# Altium project PYRAMIDE CONTROLLER VER01 REVA.PrjPcb (part 1 of 2)
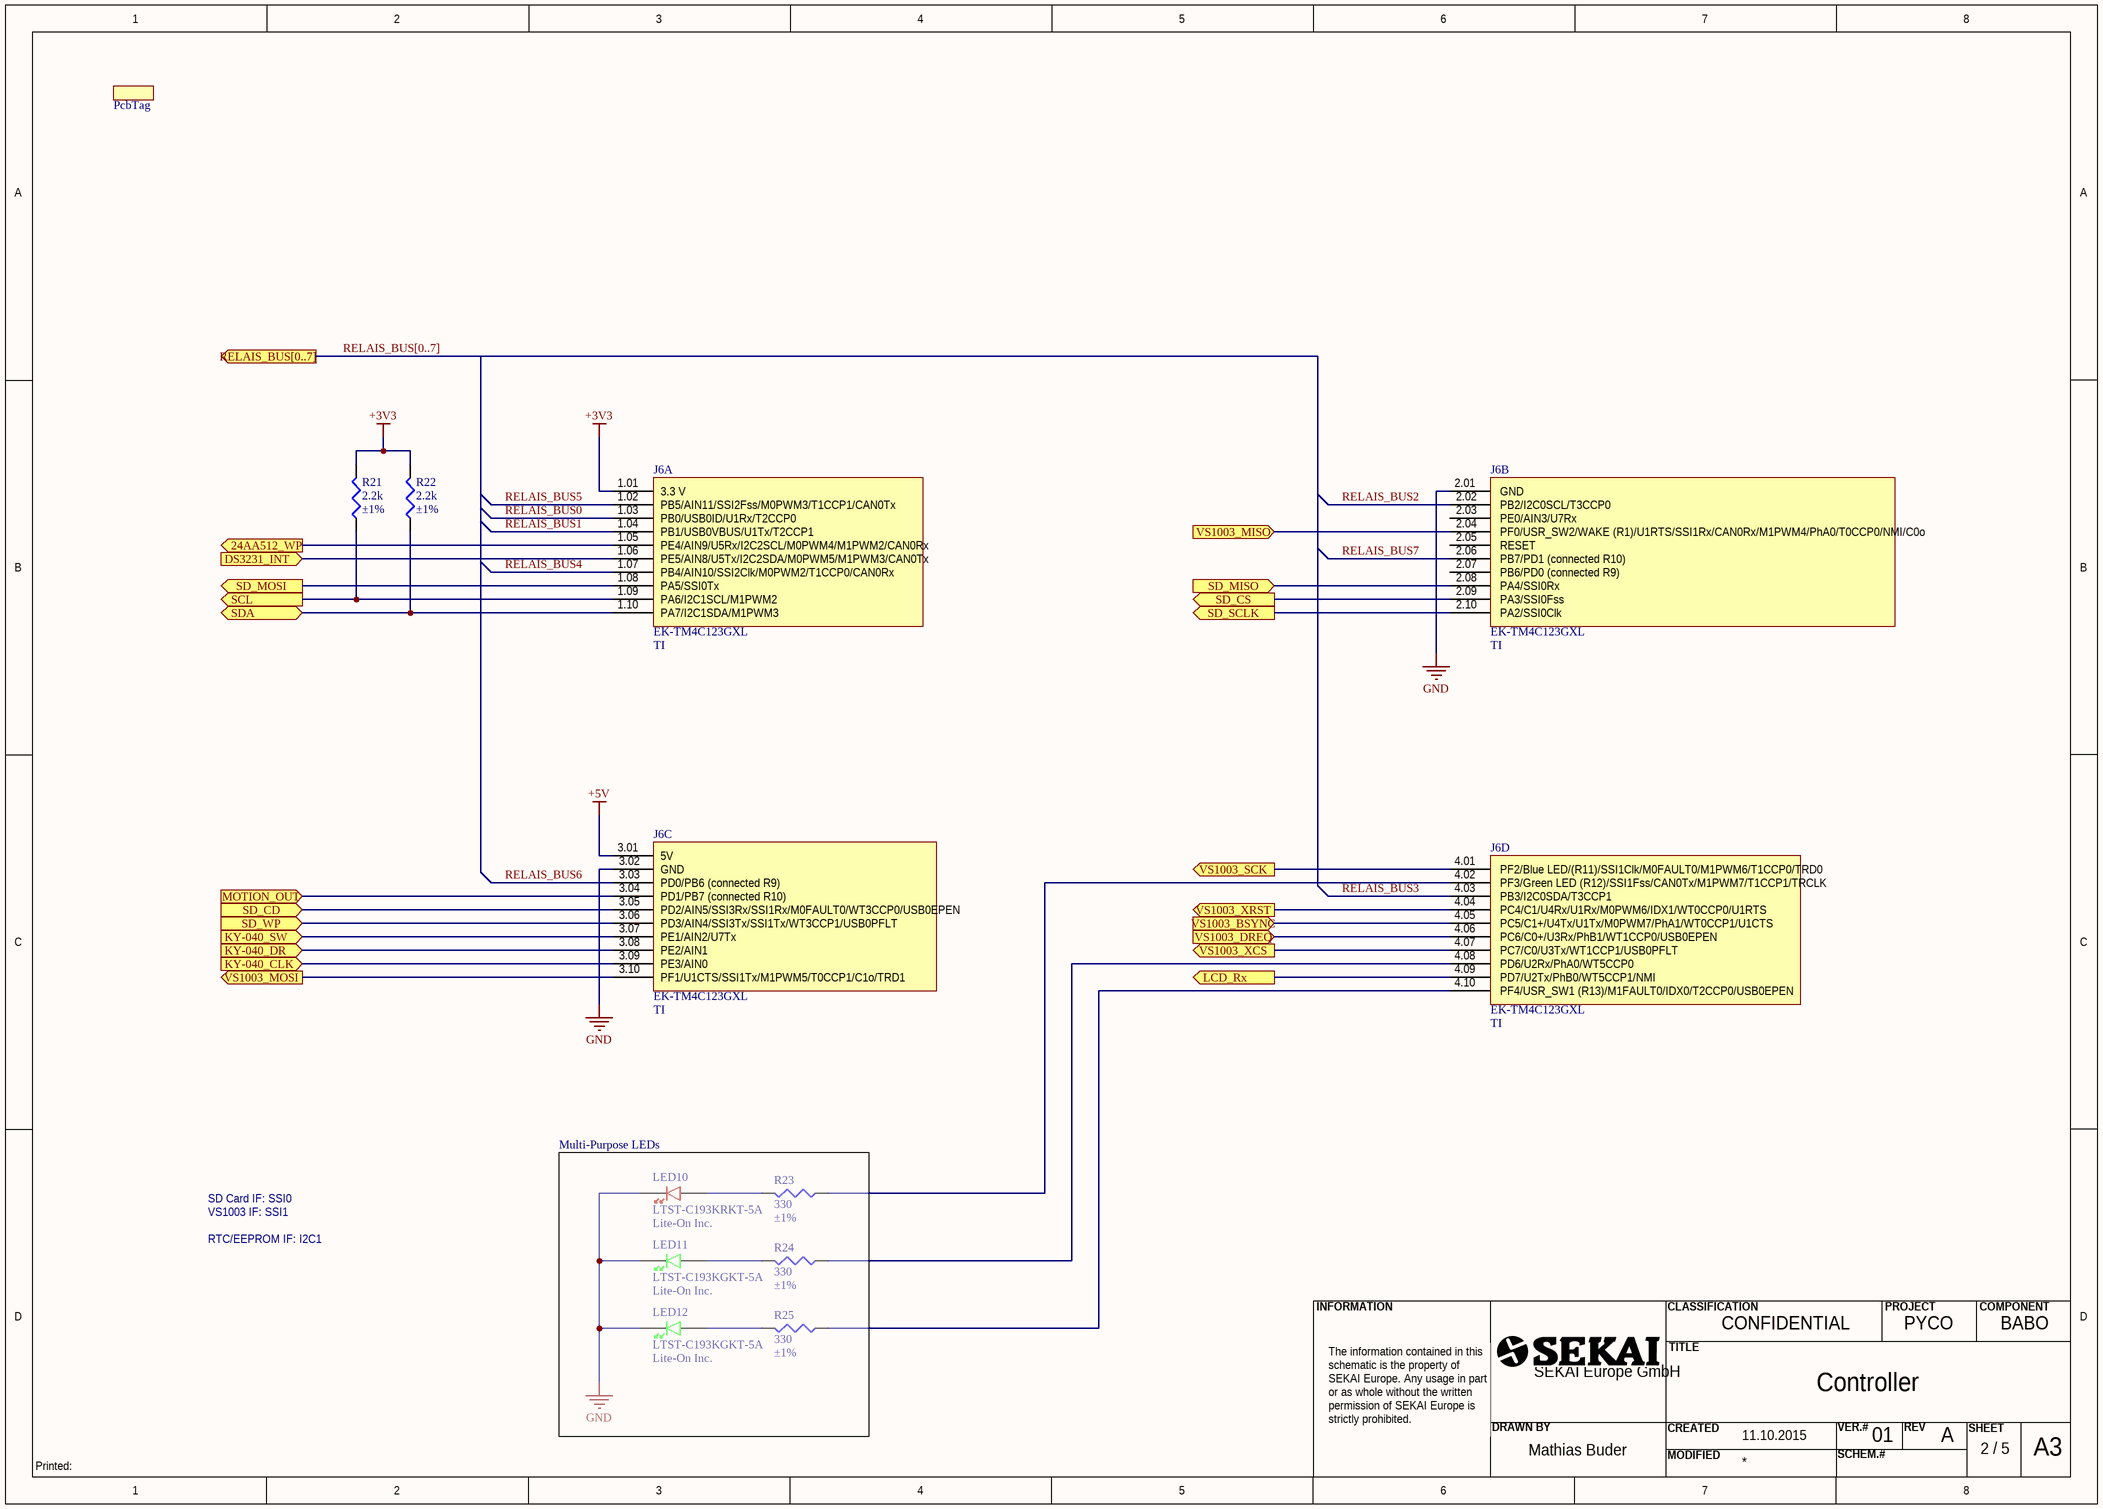
[diagram p0: Controller.SchDoc]
Classification: CONFIDENTIAL; Component: BABO; Drawn by: Mathias Buder; Project: PYCO; ProjectTitle: Pyramide Controller; REV: A; VER: 01
4 sheets, 96 parts. Net scope: flat (ports and power ports of the same name join across sheets).
Board file: PYCO_PCB_VER01_REVA.PcbDoc
Sheets:
  Controller.SchDoc
  Power Supply.SchDoc
  RTC-EEPROM.SchDoc
  Connectors.SchDoc

## Sheet Controller.SchDoc: Controller
size A3; Date: 11.10.2015; DocumentNumber: 2; Revision: 11; SheetNumber: 2; SheetTotal: 5

### Parts
?  PcbTag  [PcbTag]
J6  EK-TM4C123GXL  Manufacturer: TI  [EK-TM4C123GXL]  (parts A,B,C,D of 4)
LED10  LTST-C193KRKT-5A  Manufacturer: Lite-On Inc.  [LED0603-RED]
LED11  LTST-C193KGKT-5A  Manufacturer: Lite-On Inc.  [LED0603-GREEN]
LED12  LTST-C193KGKT-5A  Manufacturer: Lite-On Inc.  [LED0603-GREEN]
R21  Resistance (Ohms): 2.2k  Tolerance: ±1%  [R0603]  (hidden comment: ERJ-3EKF2201V)
R22  Resistance (Ohms): 2.2k  Tolerance: ±1%  [R0603]  (hidden comment: ERJ-3EKF2201V)
R23  Resistance (Ohms): 330  Tolerance: ±1%  [R0603]  (hidden comment: ERJ-3EKF3300V)
R24  Resistance (Ohms): 330  Tolerance: ±1%  [R0603]  (hidden comment: ERJ-3EKF3300V)
R25  Resistance (Ohms): 330  Tolerance: ±1%  [R0603]  (hidden comment: ERJ-3EKF3300V)

### Blocks framed on the sheet
Multi-Purpose LEDs: LED10-LED12 R23-R25

### Ports
24AA512_WP (out), DS3231_INT (in), KY-040_CLK (in), KY-040_DR (in), KY-040_SW (in), LCD_Rx (out), MOTION_OUT (in), RELAIS_BUS[0..7] (out), SCL (out), SD_CD (in), SD_CS (out), SD_MISO (in), SD_MOSI (out), SD_SCLK (out), SD_WP (in), SDA (bidir), VS1003_BSYNC (in), VS1003_DREQ (in), VS1003_MISO (in), VS1003_MOSI (out), VS1003_SCK (out), VS1003_XCS (out), VS1003_XRST (out)

### Nets
+3V3: J6.1.01(3.3_V) R21.2 R22.2
+5V: J6.3.01(5V)
GND: J6.2.01(GND) J6.3.02(GND) LED10.2(CATHODE) LED11.2(CATHODE) LED12.2(CATHODE)
RELAIS_BUS0: J6.1.03(PB0/USB0ID/U1Rx/T2CCP0)
RELAIS_BUS1: J6.1.04(PB1/USB0VBUS/U1Tx/T2CCP1)
RELAIS_BUS2: J6.2.02(PB2/I2C0SCL/T3CCP0)
RELAIS_BUS3: J6.4.03(PB3/I2C0SDA/T3CCP1)
RELAIS_BUS4: J6.1.07(PB4/AIN10/SSI2Clk/M0PWM2/T1CCP0/CAN0Rx)
RELAIS_BUS5: J6.1.02(PB5/AIN11/SSI2Fss/M0PWM3/T1CCP1/CAN0Tx)
RELAIS_BUS6: J6.3.03(PD0/PB6_(connected_R9))
RELAIS_BUS7: J6.2.06(PB7/PD1_(connected_R10))
NetIC1_5: J6.1.10(PA7/I2C1SDA/M1PWM3) R22.1 ; port SDA
NetIC1_6: J6.1.09(PA6/I2C1SCL/M1PWM2) R21.1 ; port SCL
NetIC1_7: J6.1.05(PE4/AIN9/U5Rx/I2C2SCL/M0PWM4/M1PWM2/CAN0Rx) ; port 24AA512_WP
NetIC2_3: J6.1.06(PE5/AIN8/U5Tx/I2C2SDA/M0PWM5/M1PWM3/CAN0Tx) ; port DS3231_INT
NetIC3_2: J6.3.07(PE1/AIN2/U7Tx) ; port KY-040_SW
NetIC3_3: J6.3.08(PE2/AIN1) ; port KY-040_DR
NetIC3_4: J6.3.09(PE3/AIN0) ; port KY-040_CLK
NetIC4_3: J6.4.09(PD7/U2Tx/PhB0/WT5CCP1/NMI) ; port LCD_Rx
NetJ3_2: J6.3.04(PD1/PB7_(connected_R10)) ; port MOTION_OUT
NetJ4_1: J6.4.05(PC5/C1+/U4Tx/U1Tx/M0PWM7/PhA1/WT0CCP1/U1CTS) ; port VS1003_BSYNC
NetJ4_2: J6.4.07(PC7/C0/U3Tx/WT1CCP1/USB0PFLT) ; port VS1003_XCS
NetJ4_3: J6.4.04(PC4/C1/U4Rx/U1Rx/M0PWM6/IDX1/WT0CCP0/U1RTS) ; port VS1003_XRST
NetJ4_4: J6.4.06(PC6/C0+/U3Rx/PhB1/WT1CCP0/USB0EPEN) ; port VS1003_DREQ
NetJ4_5: J6.4.01(PF2/Blue_LED/(R11)/SSI1Clk/M0FAULT0/M1PWM6/T1CCP0/TRD0) ; port VS1003_SCK
NetJ4_6: J6.3.10(PF1/U1CTS/SSI1Tx/M1PWM5/T0CCP1/C1o/TRD1) ; port VS1003_MOSI
NetJ4_7: J6.2.04(PF0/USR_SW2/WAKE_(R1)/U1RTS/SSI1Rx/CAN0Rx/M1PWM4/PhA0/T0CCP0/NMI/C0o) ; port VS1003_MISO
NetJ6_1.08: J6.1.08(PA5/SSI0Tx) ; port SD_MOSI
NetJ6_2.08: J6.2.08(PA4/SSI0Rx) ; port SD_MISO
NetJ6_2.09: J6.2.09(PA3/SSI0Fss) ; port SD_CS
NetJ6_2.10: J6.2.10(PA2/SSI0Clk) ; port SD_SCLK
NetJ6_3.05: J6.3.05(PD2/AIN5/SSI3Rx/SSI1Rx/M0FAULT0/WT3CCP0/USB0EPEN) ; port SD_CD
NetJ6_3.06: J6.3.06(PD3/AIN4/SSI3Tx/SSI1Tx/WT3CCP1/USB0PFLT) ; port SD_WP
NetJ6_4.02: J6.4.02(PF3/Green_LED_(R12)/SSI1Fss/CAN0Tx/M1PWM7/T1CCP1/TRCLK) R23.1
NetJ6_4.08: J6.4.08(PD6/U2Rx/PhA0/WT5CCP0) R24.1
NetJ6_4.10: J6.4.10(PF4/USR_SW1_(R13)/M1FAULT0/IDX0/T2CCP0/USB0EPEN) R25.1
NetLED10_1: LED10.1(ANODE) R23.2
NetLED11_1: LED11.1(ANODE) R24.2
NetLED12_1: LED12.1(ANODE) R25.2

Not connected (* = marked no-connect by the designer): J6 2.03(PE0/AIN3/U7Rx) 2.05(RESET) 2.07(PB6/PD0_(connected_R9))

### Buses and harness runs
bus RELAIS_BUS[0..7] = port RELAIS_BUS[0..7]

### Notes on the sheet
- VS1003 IF: SSI1
- SD Card IF: SSI0
- RTC/EEPROM IF: I2C1
- INFORMATION
- CLASSIFICATION
- PROJECT
- COMPONENT
- SEKAI Europe GmbH
- TITLE
- The information contained in this schematic is the property of SEKAI Europe. Any usage in part or as whole without the written permission of SEKAI Europe is strictly prohibited.
- DRAWN BY
- CREATED
- MODIFIED
- VER.#
- SCHEM.#
- REV
- SHEET
- A3
- Printed:

### Library data of the parts
J6 = EK-TM4C123GXL: EVAL KIT TM4C123GXL LAUNCHPAD; Board Type: Evaluation Platform; Core Processor: ARM® Cortex®-M4F; Platform: LaunchPad™; Contents: Board(s), Cable(s); Supplier 1: Digi-Key; Manufacturer Part Number: EK-TM4C123GXL; RoHS: RoHS Compliant By Exemption; Category: Programmers, Development Systems; Stock 1: 1173; Pricing 1: 1=12.03 (EUR); Type: MCU 32-Bit; Operating System: -; For Use With/Related Products: TM4C123G; Mounting Type: Fixed; ComponentLink1URL: http://www.ti.com/lit/pdf/spmu296; ComponentLink1Description: http://www.ti.com/lit/pdf/spmu296; Supplier Part Number 1: 296-35760-ND
LED10 = LTST-C193KRKT-5A: LED RED CLEAR 0603 SMD; Wavelength - Dominant: 631nm; Wavelength - Peak: 639nm; Millicandela Rating: 26.05mcd; Voltage - Forward (Vf) (Typ): 2V; Current - Test: 5mA; Viewing Angle: 130°; Lens Color: Colorless; Lens Style/Size: Rectangle with Flat Top, 1.15mm x 0.80mm; Supplier 1: Digi-Key; Manufacturer Part Number: LTST-C193KRKT-5A; RoHS: RoHS Compliant; Category: Optoelectronics; Stock 1: 115770; Pricing 1: 1=0.38, 10=0.276, 100=0.1461, 250=0.10336, 500=0.0882, 1000=0.0689 (EUR); Packaging: Cut Tape (CT); Color: Red; Lens Transparency: Clear; Package / Case: 0603 (1608 Metric); Supplier Device Package: *; Size / Dimension: 1.60mm L x 0.80mm W; Height (Max): 0.35mm; Mounting Type: Surface Mount; ComponentLink1URL: http://optoelectronics.liteon.com/upload/download/DS22-2005-077/S_110_LTST-C193KRKT-5A.pdf; ComponentLink1Description: http://optoelectronics.liteon.com/upload/download/DS22-2005-077/S_110_LTST-C193KRKT-5A.pdf; Supplier Part Number 1: 160-1830-1-ND
LED11 LED12 = LTST-C193KGKT-5A: LED GREEN CLEAR 0603 SMD; Wavelength - Dominant: 572nm; Wavelength - Peak: 574nm; Millicandela Rating: 16.25mcd; Voltage - Forward (Vf) (Typ): 2V; Current - Test: 5mA; Viewing Angle: 130°; Lens Color: Colorless; Lens Style/Size: Rectangle with Flat Top, 1.15mm x 0.80mm; Supplier 1: Digi-Key; Manufacturer Part Number: LTST-C193KGKT-5A; RoHS: RoHS Compliant; Category: Optoelectronics; Stock 1: 64103; Pricing 1: 1=0.38, 10=0.276, 100=0.1461, 250=0.10336, 500=0.0882, 1000=0.0689 (EUR); Packaging: Digi-Reel®; Color: Green; Lens Transparency: Clear; Package / Case: 0603 (1608 Metric); Supplier Device Package: *; Size / Dimension: 1.60mm L x 0.80mm W; Height (Max): 0.35mm; Mounting Type: Surface Mount; ComponentLink1URL: http://optoelectronics.liteon.com/upload/download/DS22-2007-0094/S_110_LTST-C193KGKT-5A.pdf; ComponentLink1Description: http://optoelectronics.liteon.com/upload/download/DS22-2007-0094/S_110_LTST-C193KGKT-5A.pdf; Supplier Part Number 1: 160-1828-6-ND
R21 R22 = ERJ-3EKF2201V: RES SMD 2.2K OHM 1% 1/10W 0603; Manufacturer: Panasonic Electronic Components; Power (Watts): 0.1W, 1/10W; Temperature Coefficient: ±100ppm/°C; Supplier 1: Digi-Key; Manufacturer Part Number: ERJ-3EKF2201V; RoHS: RoHS Compliant; Category: Resistors; Stock 1: 517387; Pricing 1: 1=0.1, 50=0.0154, 100=0.0117, 250=0.00864, 500=0.00638, 1000=0.00426, 2500=0.0036 (EUR); Packaging: Cut Tape (CT); Composition: Thick Film; Features: Automotive AEC-Q200; Operating Temperature: -55°C ~ 155°C; Package / Case: 0603 (1608 Metric); Supplier Device Package: 0603; Size / Dimension: 0.063" L x 0.031" W (1.60mm x 0.80mm); Height: 0.022" (0.55mm); Number of Terminations: 2; ComponentLink1URL: http://industrial.panasonic.com/www-cgi/jvcr13pz.cgi?E+PZ+3+AOA0002+ERJ3EKF2201V+7+WW; ComponentLink1Description: http://industrial.panasonic.com/www-cgi/jvcr13pz.cgi?E+PZ+3+AOA0002+ERJ3EKF2201V+7+WW; Supplier Part Number 1: P2.20KHCT-ND
R23-R25 = ERJ-3EKF3300V: RES SMD 330 OHM 1% 1/10W 0603; Manufacturer: Panasonic Electronic Components; Power (Watts): 0.1W, 1/10W; Temperature Coefficient: ±100ppm/°C; Supplier 1: Digi-Key; Manufacturer Part Number: ERJ-3EKF3300V; RoHS: RoHS Compliant; Category: Resistors; Stock 1: 360334; Pricing 1: 1=0.1, 50=0.0154, 100=0.0117, 250=0.00864, 500=0.00638, 1000=0.00426, 2500=0.0036 (EUR); Packaging: Cut Tape (CT); Composition: Thick Film; Features: Automotive AEC-Q200; Operating Temperature: -55°C ~ 155°C; Package / Case: 0603 (1608 Metric); Supplier Device Package: 0603; Size / Dimension: 0.063" L x 0.031" W (1.60mm x 0.80mm); Height: 0.022" (0.55mm); Number of Terminations: 2; ComponentLink1URL: http://industrial.panasonic.com/www-cgi/jvcr13pz.cgi?E+PZ+3+AOA0002+ERJ3EKF3300V+7+WW; ComponentLink1Description: http://industrial.panasonic.com/www-cgi/jvcr13pz.cgi?E+PZ+3+AOA0002+ERJ3EKF3300V+7+WW; Supplier Part Number 1: P330HCT-ND

## Sheet Power Supply.SchDoc: Power Supply
size A3; Date: 15.10.2015; DocumentNumber: 3; Revision: 11; SheetNumber: 3; SheetTotal: 5
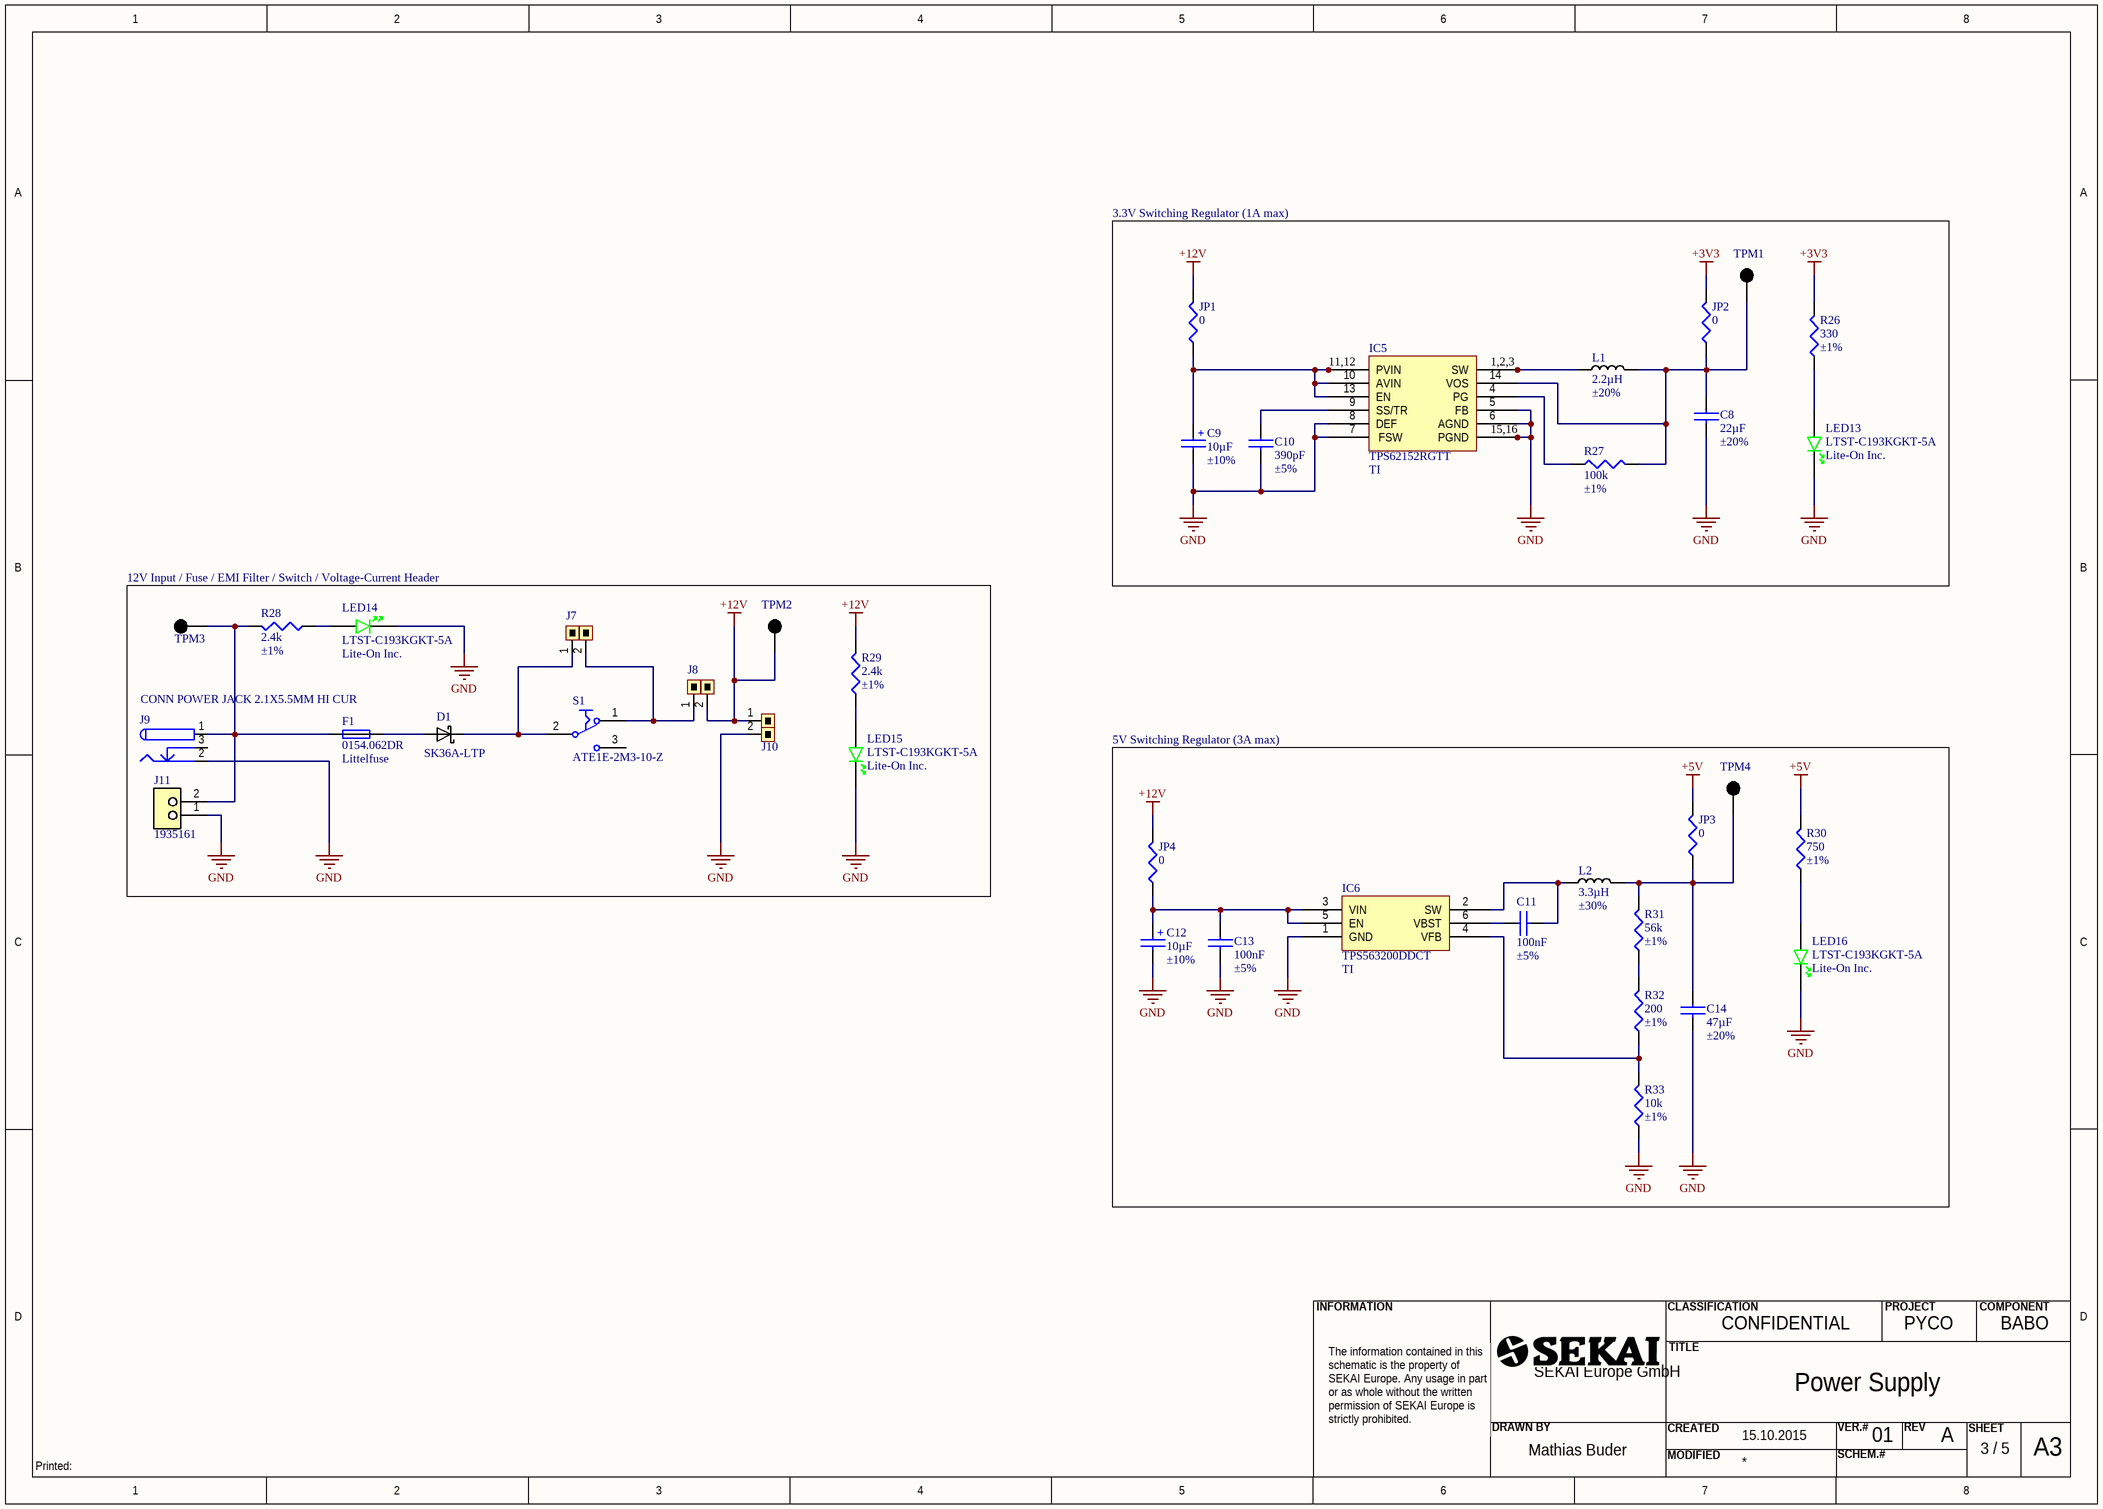
[diagram p1: Power Supply.SchDoc]

### Parts
C8  Capacitance: 22µF  Tolerance: ±20%  [C0805]  (hidden comment: C2012X5R0J226M125AC)
C9  Kapazität: 10µF  Toleranz: ±10%  [C1206]  (hidden comment: T491A106K016AT)
C10  Capacitance: 390pF  Tolerance: ±5%  [C0603]  (hidden comment: GRM1885C1H391JA01D)
C11  Kapazität: 100nF  Toleranz: ±5%  [C0603]  (hidden comment: C0603C104J4RACTU)
C12  Kapazität: 10µF  Toleranz: ±10%  [C1206]  (hidden comment: T491A106K016AT)
C13  Kapazität: 100nF  Toleranz: ±5%  [C0603]  (hidden comment: C0603C104J4RACTU)
C14  Capacitance: 47µF  Tolerance: ±20%  [C1206]  (hidden comment: C3216X6S1A476M160AC)
D1  SK36A-LTP  [DO-214AC]
F1  0154.062DR  Manufacturer: Littelfuse  [0154.062DR]
IC5  TPS62152RGTT  Manufacturer: TI  [QFN16]
IC6  TPS563200DDCT  Manufacturer: TI  [SOT23-6]
J7  1x2  [Post Height Terminal Strip 1x2]  (value not drawn)
J8  1x2  [Post Height Terminal Strip 1x2]  (value not drawn)
J9  CONN POWER JACK 2.1X5.5MM HI CUR  [CP-002AHPJCT-ND]
J10  1x2  [Post Height Terminal Strip 1x2]  (value not drawn)
J11  1935161  [2 POS Screw Terminal]
JP1  Resistance (Ohms): 0  [R0603]  (hidden comment: ERJ-3GEY0R00V)
JP2  Resistance (Ohms): 0  [R0603]  (hidden comment: ERJ-3GEY0R00V)
JP3  Resistance (Ohms): 0  [R0603]  (hidden comment: ERJ-3GEY0R00V)
JP4  Resistance (Ohms): 0  [R0603]  (hidden comment: ERJ-3GEY0R00V)
L1  Inductance: 2.2µH  Tolerance: ±20%  [IND-LQH32CN220K53L 2 11]  (hidden comment: SDR0403-2R2ML)
L2  Inductance: 3.3µH  Tolerance: ±30%  [SRR6038-3R3Y]  (hidden comment: SRR6038-3R3Y)
LED13  LTST-C193KGKT-5A  Manufacturer: Lite-On Inc.  [LED0603-GREEN]
LED14  LTST-C193KGKT-5A  Manufacturer: Lite-On Inc.  [LED0603-GREEN]
LED15  LTST-C193KGKT-5A  Manufacturer: Lite-On Inc.  [LED0603-GREEN]
LED16  LTST-C193KGKT-5A  Manufacturer: Lite-On Inc.  [LED0603-GREEN]
R26  Resistance (Ohms): 330  Tolerance: ±1%  [R0603]  (hidden comment: ERJ-3EKF3300V)
R27  Resistance (Ohms): 100k  Tolerance: ±1%  [R0603]  (hidden comment: ERJ-3EKF1003V)
R28  Resistance (Ohms): 2.4k  Tolerance: ±1%  [R0603]  (hidden comment: ERJ-3EKF2401V)
R29  Resistance (Ohms): 2.4k  Tolerance: ±1%  [R0603]  (hidden comment: ERJ-3EKF2401V)
R30  Resistance (Ohms): 750  Tolerance: ±1%  [R0603]  (hidden comment: ERJ-3EKF7500V)
R31  Resistance (Ohms): 56k  Tolerance: ±1%  [R0603]  (hidden comment: ERJ-3EKF5602V)
R32  Resistance (Ohms): 200  Tolerance: ±1%  [R0603]  (hidden comment: ERJ-3EKF2000V)
R33  Resistance (Ohms): 10k  Tolerance: ±1%  [R0603]  (hidden comment: ERJ-3EKF1002V)
S1  ATE1E-2M3-10-Z  [ATE1E-2M3-10-Z]
TPM1  TestPoint-M  [TestPoint-M]  (value not drawn)
TPM2  TestPoint-M  [TestPoint-M]  (value not drawn)
TPM3  TestPoint-M  [TestPoint-M]  (value not drawn)
TPM4  TestPoint-M  [TestPoint-M]  (value not drawn)

### Blocks framed on the sheet
3.3V Switching Regulator (1A max): C8-C10 IC5 JP1 JP2 L1 LED13 R26 R27 TPM1
5V Switching Regulator (3A max): C11-C14 IC6 JP3 JP4 L2 LED16 R30-R33 TPM4

### Nets
+3V3: JP2.2 R26.2
+5V: JP3.2 R30.2
+12V: J8.2 J10.1 JP1.2 JP4.2 R29.2 TPM2.1
GND: C8.2 C9.2 C10.2 C12.2 C13.2 C14.2 IC5.5(FB) IC5.6(AGND) IC5.7(FSW) IC5.8(DEF) IC5.15(PGND) IC5.16(PGND) IC6.1(GND) J9.2 J10.2 J11.1 LED13.2(CATHODE) LED14.2(CATHODE) LED15.2(CATHODE) LED16.2(CATHODE) R33.1
NetC8_1: C8.1 IC5.14(VOS) JP2.1 L1.2 R27.2 TPM1.1
NetC9_1: C9.1 IC5.10(AVIN) IC5.11(PVIN) IC5.12(PVIN) IC5.13(EN) JP1.1
NetC10_1: C10.1 IC5.9(SS/TR)
NetC11_1: C11.1 IC6.6(VBST)
NetC11_2: C11.2 IC6.2(SW) L2.1
NetC12_1: C12.1 C13.1 IC6.3(VIN) IC6.5(EN) JP4.1
NetC14_1: C14.1 JP3.1 L2.2 R31.2 TPM4.1
NetD1_1: D1.1(ANODE) F1.2
NetD1_2: D1.2(CATHODE) J7.1 S1.2
NetF1_1: F1.1 J9.1 J11.2 R28.2 TPM3.1
NetIC5_1: IC5.1(SW) IC5.2(SW) IC5.3(SW) L1.1
NetIC5_4: IC5.4(PG) R27.1
NetIC6_4: IC6.4(VFB) R32.1 R33.2
NetJ7_2: J7.2 J8.1 S1.1
NetLED13_1: LED13.1(ANODE) R26.1
NetLED14_1: LED14.1(ANODE) R28.1
NetLED15_1: LED15.1(ANODE) R29.1
NetLED16_1: LED16.1(ANODE) R30.1
NetR31_1: R31.1 R32.2

Not connected (* = marked no-connect by the designer): J9 3; S1 3

### Notes on the sheet
- 12V Input / Fuse / EMI Filter / Switch / Voltage-Current Header
- INFORMATION
- CLASSIFICATION
- PROJECT
- COMPONENT
- SEKAI Europe GmbH
- TITLE
- The information contained in this schematic is the property of SEKAI Europe. Any usage in part or as whole without the written permission of SEKAI Europe is strictly prohibited.
- DRAWN BY
- CREATED
- MODIFIED
- VER.#
- SCHEM.#
- REV
- SHEET
- A3
- Printed:
- (in symbol T491A106K016AT) +
- (in symbol TPS62152RGTT) 11,12; 1,2,3; 15,16

### Library data of the parts
C8 = C2012X5R0J226M125AC: CAP CER 22UF 6.3V X5R 0805; Manufacturer: TDK Corporation; Supplier 1: Digi-Key; Manufacturer Part Number: C2012X5R0J226M125AC; RoHS: RoHS Compliant; Category: Capacitors; Stock 1: 383614; Pricing 1: 1=0.26, 10=0.214, 100=0.107, 250=0.08028, 500=0.07092, 1000=0.06289 (EUR); Packaging: Digi-Reel®; Voltage - Rated: 6.3V; Temperature Coefficient: X5R; Mounting Type: Surface Mount, MLCC; Operating Temperature: -55°C ~ 85°C; Applications: General Purpose; Ratings: -; Package / Case: 0805 (2012 Metric); Size / Dimension: 0.079" L x 0.049" W (2.00mm x 1.25mm); Height - Seated (Max): -; Thickness (Max): 0.057" (1.45mm); Lead Spacing: -; Features: -; Lead Style: -; ComponentLink1URL: http://product.tdk.com/en/catalog/datasheets/mlcc_commercial_general_en.pdf; ComponentLink1Description: http://product.tdk.com/en/catalog/datasheets/mlcc_commercial_general_en.pdf; Supplier Part Number 1: 445-1422-6-ND
C9 C12 = T491A106K016AT: CAP TANT 10UF 16V 10% 1206; Manufacturer: Kemet; Verpackung: Am Band (Cut Tape - CT); ESR (Gleichwertiger Reihenwiderstand): 7 Ohm; Typ: Vergossen; Betriebstemperatur: -55°C bis 125°C; Montagetyp: Oberflächenmontage; Gehäuse / Hülle: 1206 (3216 Metrisch); Höhe - eingesteckt (max.): 0,071" (1,80 mm); Hersteller-Größencode: A; Funktionen: Allgemeiner Verwendungszweck; Lebensdauer @ Temp.: 2000 Std @ 85°C; Supplier 1: Digi-Key; Manufacturer Part Number: T491A106K016AT; RoHS: RoHS Compliant; Category: Kondensatoren; Stock 1: 130191; Pricing 1: 1=0.43, 10=0.378, 25=0.27, 50=0.2296, 100=0.189, 250=0.15112, 1000=0.12172 (EUR); Spannung - Nennwert: 16V; Grösse / Dimension: L x B: 0,126" x 0,063" (3,20 mm x 1,60 mm); Rastermaß: -; ComponentLink1URL: http://www.kemet.com/Lists/ProductCatalog/Attachments/254/KEM_T2005_T491.pdf; ComponentLink1Description: http://www.kemet.com/Lists/ProductCatalog/Attachments/254/KEM_T2005_T491.pdf; Supplier Part Number 1: 399-8269-1-ND
C10 = GRM1885C1H391JA01D: CAP CER 390PF 50V NP0 0603; Manufacturer: Murata Electronics North America; Temperature Coefficient: C0G, NP0; Supplier 1: Digi-Key; Manufacturer Part Number: GRM1885C1H391JA01D; RoHS: RoHS Compliant; Category: Capacitors; Stock 1: 44107; Pricing 1: 1=0.14, 10=0.099, 50=0.0536, 100=0.0451, 250=0.03696, 500=0.03162, 1000=0.02462 (EUR); Packaging: Cut Tape (CT); Voltage - Rated: 50V; Mounting Type: Surface Mount, MLCC; Operating Temperature: -55°C ~ 125°C; Applications: General Purpose; Ratings: -; Package / Case: 0603 (1608 Metric); Size / Dimension: 0.063" L x 0.031" W (1.60mm x 0.80mm); Height - Seated (Max): -; Thickness (Max): 0.035" (0.90mm); Lead Spacing: -; Features: -; Lead Style: -; ComponentLink1URL: http://www.murata.com/~/media/webrenewal/support/library/catalog/products/capacitor/mlcc/c02e.ashx; ComponentLink1Description: http://www.murata.com/~/media/webrenewal/support/library/catalog/products/capacitor/mlcc/c02e.ashx; Supplier Part Number 1: 490-1441-1-ND
C11 C13 = C0603C104J4RACTU: CAP CER 100NF 16V 5% X7R 0603; Manufacturer: Kemet; Verpackung: Am Band (Cut Tape - CT); Montagetyp: Oberflächenmontage, MLCC; Betriebstemperatur: -55°C bis 125°C; Anwendungen: Mehrzweckanwendungen; Gehäuse / Hülle: 0603 (1608 Metrisch); Dicke (max.): 0,034" (0,87 mm); Supplier 1: Digi-Key; Manufacturer Part Number: C0603C104J4RACTU; RoHS: RoHS Compliant; Category: Kondensatoren; Stock 1: 557573; Pricing 1: 1=0.11, 10=0.079, 25=0.0584, 50=0.045, 100=0.0372, 250=0.03132, 1000=0.02112 (EUR); Spannung - Nennwert: 16V; Temperaturwirkungsgrad: X7R; Nenngrößen: -; Grösse / Dimension: L x B: 0,063" x 0,031" (1,60 mm x 0,80 mm); Höhe - eingesteckt (max.): -; Rastermaß: -; Funktionen: -; Leitungstyp: -; ComponentLink1URL: http://www.kemet.com/docfinder?Partnumber=C0603C104J4RACTU; ComponentLink1Description: http://www.kemet.com/docfinder?Partnumber=C0603C104J4RACTU; Supplier Part Number 1: 399-1097-1-ND
C14 = C3216X6S1A476M160AC: CAP CER 47UF 10V X6S 1206; Manufacturer: TDK Corporation; Supplier 1: Digi-Key; Manufacturer Part Number: C3216X6S1A476M160AC; RoHS: RoHS Compliant; Category: Capacitors; Stock 1: 39668; Pricing 1: 1=0.96, 10=0.816, 100=0.4773, 250=0.40028, 500=0.36178, 1000=0.331 (EUR); Packaging: Digi-Reel®; Voltage - Rated: 10V; Temperature Coefficient: X6S; Mounting Type: Surface Mount, MLCC; Operating Temperature: -55°C ~ 105°C; Applications: General Purpose; Ratings: -; Package / Case: 1206 (3216 Metric); Size / Dimension: 0.126" L x 0.063" W (3.20mm x 1.60mm); Height - Seated (Max): -; Thickness (Max): 0.071" (1.80mm); Lead Spacing: -; Features: -; Lead Style: -; ComponentLink1URL: http://product.tdk.com/en/catalog/datasheets/mlcc_commercial_general_en.pdf; ComponentLink1Description: http://product.tdk.com/en/catalog/datasheets/mlcc_commercial_general_en.pdf; Supplier Part Number 1: 445-6010-6-ND
D1 = SK36A-LTP: DIODE SCHOTTKY 60V 3A DO214AC; Manufacturer: Micro Commercial Co; Voltage - Forward (Vf) (Max) @ If: 750mV @ 3A; Speed: Fast Recovery =< 500ns, > 200mA (Io); Current - Reverse Leakage @ Vr: 500µA @ 60V; Capacitance @ Vr, F: 250pF @ 4V, 1MHz; Supplier 1: Digi-Key; Manufacturer Part Number: SK36A-LTP; RoHS: RoHS Compliant; Category: Discrete Semiconductor Products; Stock 1: 46092; Pricing 1: 1=0.52, 10=0.362, 25=0.2976, 100=0.2379, 250=0.17332, 500=0.14076, 1000=0.1082, 2500=0.09717 (EUR); Packaging: Digi-Reel®; Diode Type: Schottky; Voltage - DC Reverse (Vr) (Max): 60V; Current - Average Rectified (Io): 3A; Reverse Recovery Time (trr): -; Mounting Type: Surface Mount; Package / Case: DO-214AC, SMA; Supplier Device Package: DO-214AC (SMA); Operating Temperature - Junction: -50°C ~ 125°C; ComponentLink1URL: http://www.mccsemi.com/up_pdf/SK32A-LT~SK310A-LT(DO-214AC).PDF; ComponentLink1Description: http://www.mccsemi.com/up_pdf/SK32A-LT~SK310A-LT(DO-214AC).PDF; Supplier Part Number 1: SK36A-LTPMSDKR-ND
F1 = 0154.062DR: FUSE BRD MNT 62MA 125VAC/VDC SMD; Fuse Type: Board Mount (Cartridge Style Excluded); Voltage Rating - AC: 125V; Response Time: Fast; Breaking Capacity @ Rated Voltage: 50A; Melting I²t: 0.00019; Approvals: UL; Color: White; DC Cold Resistance: 5.5 Ohm; Supplier 1: Digi-Key; Manufacturer Part Number: 0154.062DR; RoHS: RoHS Compliant; Category: Circuit Protection; Stock 1: 3445; Pricing 1: 1=4.11, 10=3.829, 25=3.41, 50=2.977, 100=2.4763, 250=2.40864, 500=2.0568 (EUR); Packaging: Cut Tape (CT); Current Rating: 62mA; Voltage Rating - DC: 125V; Package / Case: 2-SMD, Square End Block with Holder; Mounting Type: Holder/Surface Mount; Operating Temperature: -55°C ~ 125°C; Size / Dimension: 0.383" L x 0.198" W x 0.150" H (9.73mm x 5.03mm x 3.81mm); ComponentLink1URL: http://www.littelfuse.com/~/media/electronics/datasheets/fuses/littelfuse_fuse_154_154t_154l_154tl_datasheet.pdf.pdf; ComponentLink1Description: http://www.littelfuse.com/~/media/electronics/datasheets/fuses/littelfuse_fuse_154_154t_154l_154tl_datasheet.pdf.pdf; Supplier Part Number 1: F3148CT-ND
IC5 = TPS62152RGTT: IC REG BUCK 3.3V 1A SYNC 16QFN; Function: Step-Down; Output Configuration: Positive; Output Type: Fixed; Number of Outputs: 1; Voltage - Input (Min): 3V; Voltage - Input (Max): 17V; Frequency - Switching: 2.5MHz; Synchronous Rectifier: Yes; Supplier 1: Digi-Key; Manufacturer Part Number: TPS62152RGTT; RoHS: RoHS Compliant; Category: Integrated Circuits (ICs); Stock 1: 3849; Pricing 1: 1=2.49, 10=2.239, 25=1.9444, 50=1.8286, 100=1.8018 (EUR); Packaging: Cut Tape (CT); Topology: Buck; Voltage - Output (Min/Fixed): 3.3V; Voltage - Output (Max): -; Current - Output: 1A; Operating Temperature: -40°C ~ 85°C (TA); Mounting Type: Surface Mount; Package / Case: 16-VFQFN Exposed Pad; Supplier Device Package: 16-QFN (3x3); ComponentLink1URL: http://www.ti.com/lit/ds/symlink/tps62150.pdf; ComponentLink1Description: http://www.ti.com/lit/ds/symlink/tps62150.pdf; Supplier Part Number 1: 296-30009-1-ND
IC6 = TPS563200DDCT: IC REG BUCK ADJ 3A SYNC 6SOT; Function: Step-Down; Output Configuration: Positive; Output Type: Adjustable; Number of Outputs: 1; Voltage - Input (Min): 4.5V; Voltage - Input (Max): 17V; Voltage - Output (Min/Fixed): 0.76V; Voltage - Output (Max): 7V; Frequency - Switching: 650kHz; Synchronous Rectifier: Yes; Supplier 1: Digi-Key; Manufacturer Part Number: TPS563200DDCT; RoHS: RoHS Compliant; Category: Integrated Circuits (ICs); Stock 1: 3350; Pricing 1: 1=1.43, 10=1.15, 100=0.9147 (EUR); Packaging: Digi-Reel®; Topology: Buck; Current - Output: 3A; Operating Temperature: -40°C ~ 85°C (TA); Mounting Type: Surface Mount; Package / Case: SOT-23-6 Thin, TSOT-23-6; Supplier Device Package: 6-SOT; ComponentLink1URL: http://www.ti.com/lit/ds/symlink/tps563200.pdf; ComponentLink1Description: http://www.ti.com/lit/ds/symlink/tps563200.pdf; Supplier Part Number 1: 296-38434-6-ND
J7 J8 J10 = Header 1x2
J9 = PJ-002AH-SMT-TR: Manufacturer: CUI Inc; Gender: Male; Plug/Mating Plug Diameter: 2.1mm ID, 5.5mm OD; Number of Positions/Contacts: 2 Conductors, 3 Contacts; Internal Switch(s): Single Switch, Normally Closed; Shielding: Unshielded; Voltage - Rated: 24VDC; Current Rating: 5A; Supplier 1: Digi-Key; Manufacturer Part Number: PJ-002AH-SMT-TR; RoHS: RoHS Compliant; Category: Connectors, Interconnects; Stock 1: 163522; Pricing 1: 1=1.71, 10=1.33, 100=1.0146 (EUR); Connector Type: Jack; Mounting Type: Surface Mount; Termination: Solder; Features: -; Color: Black; Contact Material: Copper Alloy; Contact Material - Plating: Nickel; Housing Color: Black; Housing Material: Thermoplastic; Operating Temperature: -25°C ~ 85°C; ComponentLink1URL: http://www.cui.com/product/resource/digikeypdf/pj-002ah-smt.pdf; ComponentLink1Description: http://www.cui.com/product/resource/digikeypdf/pj-002ah-smt.pdf; Supplier Part Number 1: CP-002AHPJCT-ND
J11 = 1935161: TERM BLOCK PCB 2POS 5.0MM GREEN; Manufacturer: Phoenix Contact; Number of Levels: 1; Positions Per Level: 2; Pitch: 0.197" (5.00mm); Mating Orientation: Horizontal with Board; Current: 18A; Voltage: 300V; Wire Gauge: 12-26 AWG; Wire Termination: Screw; Torque - Screw: 0.35-0.4 Nm (3.1-3.5 Lb-In); Screw Thread: M2.6; Supplier 1: Digi-Key; Manufacturer Part Number: 1935161; RoHS: RoHS Compliant; Category: Connectors, Interconnects; Stock 1: 24413; Pricing 1: 1=0.34, 10=0.319, 50=0.3048, 100=0.2965, 250=0.27712, 500=0.25494, 1000=0.23093 (EUR); Packaging: Bulk; Mounting Type: Through Hole; Features: Interlocking (Side); Color: Green; Operating Temperature: -; Housing Material: Polyamide (PA), Nylon; Contact Material - Plating: -; Clamp Material - Plating: -; Screw Material - Plating: -; ComponentLink1URL: http://media.digikey.com/pdf/Data%20Sheets/Phoenix%20Contact%20PDFs/1935161.pdf; ComponentLink1Description: http://media.digikey.com/pdf/Data%20Sheets/Phoenix%20Contact%20PDFs/1935161.pdf; Supplier Part Number 1: 277-1667-ND
JP1-JP4 = ERJ-3GEY0R00V: RES SMD 0 OHM JUMPER 1/10W; Manufacturer: Panasonic Electronic Components; Power (Watts): 0.1W, 1/10W; Supplier 1: Digi-Key; Manufacturer Part Number: ERJ-3GEY0R00V; RoHS: RoHS Compliant; Category: Resistors; Stock 1: 5305583; Pricing 1: 1=0.1, 50=0.0128, 100=0.0098, 250=0.00732, 500=0.0054, 1000=0.0036, 2500=0.00304 (EUR); Packaging: Cut Tape (CT); Composition: Thick Film; Features: Automotive AEC-Q200; Temperature Coefficient: -; Operating Temperature: -55°C ~ 155°C; Package / Case: 0603 (1608 Metric); Supplier Device Package: 0603; Size / Dimension: 0.063" L x 0.031" W (1.60mm x 0.80mm); Height: 0.022" (0.55mm); Number of Terminations: 2; ComponentLink1URL: http://industrial.panasonic.com/www-cgi/jvcr13pz.cgi?E+PZ+3+AOA0001+ERJ3GEY0R00V+7+WW; ComponentLink1Description: http://industrial.panasonic.com/www-cgi/jvcr13pz.cgi?E+PZ+3+AOA0001+ERJ3GEY0R00V+7+WW; Supplier Part Number 1: P0.0GCT-ND
L1 = SDR0403-2R2ML: FIXED IND 2.2UH 2.6A 47 MOHM SMD; Manufacturer: Bourns Inc.; Type: Wirewound; Material - Core: Ferrite; Current - Saturation: 3.9A; Shielding: Unshielded; DC Resistance (DCR): 47 mOhm Max; Q @ Freq: 28 @ 7.96MHz; Frequency - Self Resonant: 80MHz; Frequency - Test: 1kHz; Supplier 1: Digi-Key; Manufacturer Part Number: SDR0403-2R2ML; RoHS: RoHS Compliant; Category: Inductors, Coils, Chokes; Stock 1: 11279; Pricing 1: 1=0.42, 10=0.371, 25=0.348, 50=0.3014, 100=0.2783, 250=0.2644, 500=0.2412, 1000=0.20409 (EUR); Packaging: Cut Tape (CT); Current Rating: 2.6A; Operating Temperature: -40°C ~ 125°C; Mounting Type: Surface Mount; Package / Case: Nonstandard; Size / Dimension: 0.177" L x 0.157" W (4.50mm x 4.00mm); Height - Seated (Max): 0.126" (3.20mm); Supplier Device Package: -; ComponentLink1URL: http://www.bourns.com/docs/Product-Datasheets/sdr0403.pdf; ComponentLink1Description: http://www.bourns.com/docs/Product-Datasheets/sdr0403.pdf; Supplier Part Number 1: SDR0403-2R2MLCT-ND
L2 = SRR6038-3R3Y: FIXED IND 3.3UH 3.5A 20 MOHM SMD; Manufacturer: Bourns; Type: Wirewound; Material - Core: Ferrite; Current - Saturation: 3.6A; Shielding: Shielded; DC Resistance (DCR): 20 mOhm Max; Q @ Freq: 9.8 @ 7.96MHz; Frequency - Self Resonant: 75.9MHz; Frequency - Test: 100kHz; Supplier 1: Digi-Key; Manufacturer Part Number: SRR6038-3R3Y; RoHS: RoHS Compliant; Category: Inductors, Coils, Chokes; Stock 1: 991; Pricing 1: 1=0.62, 10=0.551, 25=0.516, 50=0.4474, 100=0.413, 250=0.39232, 500=0.3579 (EUR); Packaging: Cut Tape (CT); Current Rating: 3.5A; Operating Temperature: -40°C ~ 125°C; Mounting Type: Surface Mount; Package / Case: Nonstandard; Size / Dimension: 0.268" L x 0.268" W (6.80mm x 6.80mm); Height - Seated (Max): 0.158" (4.00mm); Supplier Device Package: -; ComponentLink1URL: http://www.bourns.com/docs/Product-Datasheets/SRR6038.pdf; ComponentLink1Description: http://www.bourns.com/docs/Product-Datasheets/SRR6038.pdf; Supplier Part Number 1: SRR6038-3R3YCT-ND
LED13-LED16 = LTST-C193KGKT-5A: as LED11 on sheet Controller; Supplier 1: Digi-Key; Manufacturer Part Number: LTST-C193KGKT-5A; RoHS: RoHS Compliant; Category: Optoelectronics; Stock 1: 64103; Pricing 1: 1=0.38, 10=0.276, 100=0.1461, 250=0.10336, 500=0.0882, 1000=0.0689 (EUR); Packaging: Digi-Reel®; Color: Green; Lens Transparency: Clear; Package / Case: 0603 (1608 Metric); Supplier Device Package: *; Size / Dimension: 1.60mm L x 0.80mm W; Height (Max): 0.35mm; Mounting Type: Surface Mount; ComponentLink1URL: http://optoelectronics.liteon.com/upload/download/DS22-2007-0094/S_110_LTST-C193KGKT-5A.pdf; ComponentLink1Description: http://optoelectronics.liteon.com/upload/download/DS22-2007-0094/S_110_LTST-C193KGKT-5A.pdf; Supplier Part Number 1: 160-1828-6-ND
R26 = ERJ-3EKF3300V: as R23 on sheet Controller; Supplier 1: Digi-Key; Manufacturer Part Number: ERJ-3EKF3300V; RoHS: RoHS Compliant; Category: Resistors; Stock 1: 360334; Pricing 1: 1=0.1, 50=0.0154, 100=0.0117, 250=0.00864, 500=0.00638, 1000=0.00426, 2500=0.0036 (EUR); Packaging: Cut Tape (CT); Composition: Thick Film; Features: Automotive AEC-Q200; Operating Temperature: -55°C ~ 155°C; Package / Case: 0603 (1608 Metric); Supplier Device Package: 0603; Size / Dimension: 0.063" L x 0.031" W (1.60mm x 0.80mm); Height: 0.022" (0.55mm); Number of Terminations: 2; ComponentLink1URL: http://industrial.panasonic.com/www-cgi/jvcr13pz.cgi?E+PZ+3+AOA0002+ERJ3EKF3300V+7+WW; ComponentLink1Description: http://industrial.panasonic.com/www-cgi/jvcr13pz.cgi?E+PZ+3+AOA0002+ERJ3EKF3300V+7+WW; Supplier Part Number 1: P330HCT-ND
R27 = ERJ-3EKF1003V: RES SMD 100K OHM 1% 1/10W 0603; Manufacturer: Panasonic Electronic Components; Power (Watts): 0.1W, 1/10W; Temperature Coefficient: ±100ppm/°C; Supplier 1: Digi-Key; Manufacturer Part Number: ERJ-3EKF1003V; RoHS: RoHS Compliant; Category: Resistors; Stock 1: 3830225; Pricing 1: 1=0.1, 50=0.0154, 100=0.0117, 250=0.00864, 500=0.00638, 1000=0.00426, 2500=0.0036 (EUR); Packaging: Cut Tape (CT); Composition: Thick Film; Features: Automotive AEC-Q200; Operating Temperature: -55°C ~ 155°C; Package / Case: 0603 (1608 Metric); Supplier Device Package: 0603; Size / Dimension: 0.063" L x 0.031" W (1.60mm x 0.80mm); Height: 0.022" (0.55mm); Number of Terminations: 2; ComponentLink1URL: http://industrial.panasonic.com/www-cgi/jvcr13pz.cgi?E+PZ+3+AOA0002+ERJ3EKF1003V+7+WW; ComponentLink1Description: http://industrial.panasonic.com/www-cgi/jvcr13pz.cgi?E+PZ+3+AOA0002+ERJ3EKF1003V+7+WW; Supplier Part Number 1: P100KHCT-ND
R28 R29 = ERJ-3EKF2401V: RES SMD 2.4K OHM 1% 1/10W 0603; Manufacturer: Panasonic Electronic Components; Power (Watts): 0.1W, 1/10W; Temperature Coefficient: ±100ppm/°C; Supplier 1: Digi-Key; Manufacturer Part Number: ERJ-3EKF2401V; RoHS: RoHS Compliant; Category: Resistors; Stock 1: 66118; Pricing 1: 1=0.1, 50=0.0154, 100=0.0117, 250=0.00864, 500=0.00638, 1000=0.00426, 2500=0.0036 (EUR); Packaging: Cut Tape (CT); Composition: Thick Film; Features: Automotive AEC-Q200; Operating Temperature: -55°C ~ 155°C; Package / Case: 0603 (1608 Metric); Supplier Device Package: 0603; Size / Dimension: 0.063" L x 0.031" W (1.60mm x 0.80mm); Height: 0.022" (0.55mm); Number of Terminations: 2; ComponentLink1URL: http://industrial.panasonic.com/www-cgi/jvcr13pz.cgi?E+PZ+3+AOA0002+ERJ3EKF2401V+7+WW; ComponentLink1Description: http://industrial.panasonic.com/www-cgi/jvcr13pz.cgi?E+PZ+3+AOA0002+ERJ3EKF2401V+7+WW; Supplier Part Number 1: P2.40KHCT-ND
R30 = ERJ-3EKF7500V: RES SMD 750 OHM 1% 1/10W 0603; Manufacturer: Panasonic Electronic Components; Power (Watts): 0.1W, 1/10W; Temperature Coefficient: ±100ppm/°C; Supplier 1: Digi-Key; Manufacturer Part Number: ERJ-3EKF7500V; RoHS: RoHS Compliant; Category: Resistors; Stock 1: 4965; Pricing 1: 1=0.1, 50=0.0154, 100=0.0117, 250=0.00864, 500=0.00638, 1000=0.00426, 2500=0.0036 (EUR); Packaging: Cut Tape (CT); Composition: Thick Film; Features: Automotive AEC-Q200; Operating Temperature: -55°C ~ 155°C; Package / Case: 0603 (1608 Metric); Supplier Device Package: 0603; Size / Dimension: 0.063" L x 0.031" W (1.60mm x 0.80mm); Height: 0.022" (0.55mm); Number of Terminations: 2; ComponentLink1URL: http://industrial.panasonic.com/www-cgi/jvcr13pz.cgi?E+PZ+3+AOA0002+ERJ3EKF7500V+7+WW; ComponentLink1Description: http://industrial.panasonic.com/www-cgi/jvcr13pz.cgi?E+PZ+3+AOA0002+ERJ3EKF7500V+7+WW; Supplier Part Number 1: P750HCT-ND
R31 = ERJ-3EKF5602V: RES SMD 56K OHM 1% 1/10W 0603; Manufacturer: Panasonic Electronic Components; Power (Watts): 0.1W, 1/10W; Temperature Coefficient: ±100ppm/°C; Supplier 1: Digi-Key; Manufacturer Part Number: ERJ-3EKF5602V; RoHS: RoHS Compliant; Category: Resistors; Stock 1: 220150; Pricing 1: 1=0.1, 50=0.0154, 100=0.0117, 250=0.00864, 500=0.00638, 1000=0.00426, 2500=0.0036 (EUR); Packaging: Cut Tape (CT); Composition: Thick Film; Features: Automotive AEC-Q200; Operating Temperature: -55°C ~ 155°C; Package / Case: 0603 (1608 Metric); Supplier Device Package: 0603; Size / Dimension: 0.063" L x 0.031" W (1.60mm x 0.80mm); Height: 0.022" (0.55mm); Number of Terminations: 2; ComponentLink1URL: http://industrial.panasonic.com/www-cgi/jvcr13pz.cgi?E+PZ+3+AOA0002+ERJ3EKF5602V+7+WW; ComponentLink1Description: http://industrial.panasonic.com/www-cgi/jvcr13pz.cgi?E+PZ+3+AOA0002+ERJ3EKF5602V+7+WW; Supplier Part Number 1: P56.0KHCT-ND
R32 = ERJ-3EKF2000V: RES SMD 200 OHM 1% 1/10W 0603; Manufacturer: Panasonic Electronic Components; Power (Watts): 0.1W, 1/10W; Temperature Coefficient: ±100ppm/°C; Supplier 1: Digi-Key; Manufacturer Part Number: ERJ-3EKF2000V; RoHS: RoHS Compliant; Category: Resistors; Stock 1: 749643; Pricing 1: 1=0.1, 50=0.0154, 100=0.0117, 250=0.00864, 500=0.00638, 1000=0.00426, 2500=0.0036 (EUR); Packaging: Cut Tape (CT); Composition: Thick Film; Features: Automotive AEC-Q200; Operating Temperature: -55°C ~ 155°C; Package / Case: 0603 (1608 Metric); Supplier Device Package: 0603; Size / Dimension: 0.063" L x 0.031" W (1.60mm x 0.80mm); Height: 0.022" (0.55mm); Number of Terminations: 2; ComponentLink1URL: http://industrial.panasonic.com/www-cgi/jvcr13pz.cgi?E+PZ+3+AOA0002+ERJ3EKF2000V+7+WW; ComponentLink1Description: http://industrial.panasonic.com/www-cgi/jvcr13pz.cgi?E+PZ+3+AOA0002+ERJ3EKF2000V+7+WW; Supplier Part Number 1: P200HCT-ND
R33 = ERJ-3EKF1002V: RES SMD 10K OHM 1% 1/10W 0603; Manufacturer: Panasonic Electronic Components; Power (Watts): 0.1W, 1/10W; Temperature Coefficient: ±100ppm/°C; Supplier 1: Digi-Key; Manufacturer Part Number: ERJ-3EKF1002V; RoHS: RoHS Compliant; Category: Resistors; Stock 1: 4844013; Pricing 1: 1=0.1, 50=0.0154, 100=0.0117, 250=0.00864, 500=0.00638, 1000=0.00426, 2500=0.0036 (EUR); Packaging: Cut Tape (CT); Composition: Thick Film; Features: Automotive AEC-Q200; Operating Temperature: -55°C ~ 155°C; Package / Case: 0603 (1608 Metric); Supplier Device Package: 0603; Size / Dimension: 0.063" L x 0.031" W (1.60mm x 0.80mm); Height: 0.022" (0.55mm); Number of Terminations: 2; ComponentLink1URL: http://industrial.panasonic.com/www-cgi/jvcr13pz.cgi?E+PZ+3+AOA0002+ERJ3EKF1002V+7+WW; ComponentLink1Description: http://industrial.panasonic.com/www-cgi/jvcr13pz.cgi?E+PZ+3+AOA0002+ERJ3EKF1002V+7+WW; Supplier Part Number 1: P10.0KHCT-ND
S1 = ATE1E-2M3-10-Z: SWITCH TOGGLE SPDT 50MA 48V; Manufacturer: Copal Electronics Inc; Switch Function: On-Off-On; Current Rating: 50mA (AC/DC); Actuator Type: Standard Round; Actuator Length: 6.00mm; Illumination: Non-Illuminated; Bushing Thread: Unthreaded; Electrical Life: 50,000 Cycles; Supplier 1: Digi-Key; Manufacturer Part Number: ATE1E-2M3-10-Z; RoHS: RoHS Compliant; Category: Switches; Stock 1: 2054; Pricing 1: 1=2.6, 25=2.3824, 50=2.2742, 100=2.0575, 250=1.89504, 500=1.73264, 1000=1.51605, 5000=1.46191 (EUR); Packaging: Bulk; Circuit: SPDT; Voltage Rating - AC: 48V; Voltage Rating - DC: 48V; Illumination Type, Color: -; Illumination Voltage (Nominal): -; Mounting Type: Through Hole; Panel Cutout Dimensions: -; Termination Style: PC Pin; Ingress Protection: -; Features: Washable; Actuator Material: -; Operating Temperature: -20°C ~ 85°C; ComponentLink1URL: http://www.nidec-copal-electronics.com/e/catalog/switch/ate.pdf; ComponentLink1Description: http://www.nidec-copal-electronics.com/e/catalog/switch/ate.pdf; Supplier Part Number 1: 563-1159-ND
TPM1-TPM4 = TestPoint-M: Size: M

## Sheet RTC-EEPROM.SchDoc: RTC / EEPROM
size A3; Date: 16.10.2015; DocumentNumber: 4; Revision: 11; SheetNumber: 4; SheetTotal: 5
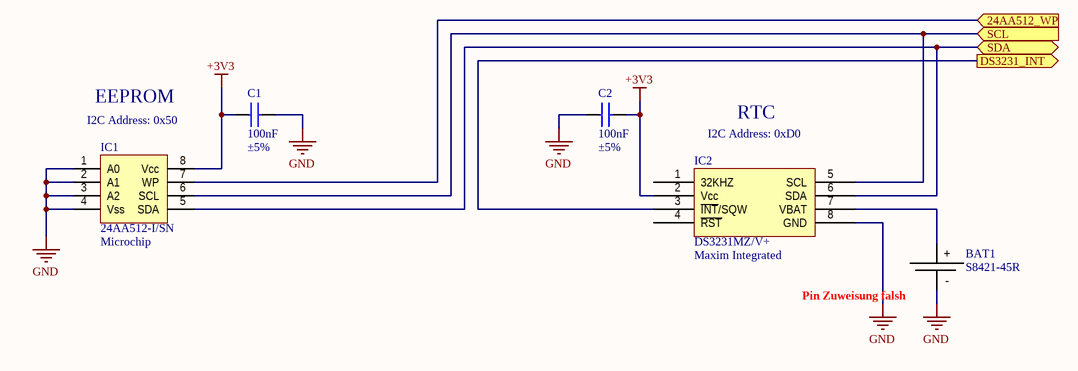
[diagram p2: RTC-EEPROM.SchDoc]

### Parts
BAT1  S8421-45R  [S8421-45R]
C1  Kapazität: 100nF  Toleranz: ±5%  [C0603]  (hidden comment: C0603C104J4RACTU)
C2  Kapazität: 100nF  Toleranz: ±5%  [C0603]  (hidden comment: C0603C104J4RACTU)
IC1  24AA512-I/SN  Manufacturer: Microchip  [SOIC-8]
IC2  DS3231MZ/V+  Manufacturer: Maxim Integrated  [SOIC-8]

### Ports
24AA512_WP (in), DS3231_INT (out), SCL (in), SDA (bidir)

### Nets
+3V3: C1.1 C2.2 IC1.8(Vcc) IC2.2(Vcc)
GND: BAT1.2 C1.2 C2.1 IC1.1(A0) IC1.2(A1) IC1.3(A2) IC1.4(Vss) IC2.8(GND)
NetBAT1_1: BAT1.1 IC2.7(VBAT)
NetIC1_5: IC1.5(SDA) IC2.6(SDA) ; port SDA
NetIC1_6: IC1.6(SCL) IC2.5(SCL) ; port SCL
NetIC1_7: IC1.7(WP) ; port 24AA512_WP
NetIC2_3: IC2.3(~{INT}/SQW) ; port DS3231_INT

Not connected (* = marked no-connect by the designer): IC2 1(32KHZ) 4(~{RST})

### Notes on the sheet
- I2C Address: 0x50
- EEPROM
- RTC
- (near IC2) I2C Address: 0xD0
- Pin Zuweisung falsh
- INFORMATION
- CLASSIFICATION
- PROJECT
- COMPONENT
- SEKAI Europe GmbH
- TITLE
- The information contained in this schematic is the property of SEKAI Europe. Any usage in part or as whole without the written permission of SEKAI Europe is strictly prohibited.
- DRAWN BY
- CREATED
- MODIFIED
- VER.#
- SCHEM.#
- REV
- SHEET
- A3
- Printed:
- (in symbol S8421-45R) +; -

### Library data of the parts
BAT1 = S8421-45R: HOLDER BATT COIN CR2032/20MM; Manufacturer: Harwin Inc.; Battery Type, Function: Coin Cell, Holder; Style: Holder (Open); Battery Cell Size: Coin, 20.0mm; Number of Cells: 1; Battery Series: 2032; Supplier 1: Digi-Key; Manufacturer Part Number: S8421-45R; RoHS: RoHS Compliant; Category: Battery Products; Stock 1: 11432; Pricing 1: 1=0.95, 10=0.855, 50=0.76, 100=0.665, 250=0.608 (EUR); Mounting Type: PCB, Surface Mount; Termination Style: SMD (SMT) Tab; Height Above Board: 0.185" (4.70mm); Operating Temperature: -40°C ~ 105°C; ComponentLink1URL: http://cdn.harwin.com/pdfs/S8421R.pdf; ComponentLink1Description: http://cdn.harwin.com/pdfs/S8421R.pdf; Supplier Part Number 1: 952-1737-1-ND
C1 C2 = C0603C104J4RACTU: as C11 on sheet Power Supply; Supplier 1: Digi-Key; Manufacturer Part Number: C0603C104J4RACTU; RoHS: RoHS Compliant; Category: Kondensatoren; Stock 1: 557573; Pricing 1: 1=0.11, 10=0.079, 25=0.0584, 50=0.045, 100=0.0372, 250=0.03132, 1000=0.02112 (EUR); Spannung - Nennwert: 16V; Temperaturwirkungsgrad: X7R; Nenngrößen: -; Grösse / Dimension: L x B: 0,063" x 0,031" (1,60 mm x 0,80 mm); Höhe - eingesteckt (max.): -; Rastermaß: -; Funktionen: -; Leitungstyp: -; ComponentLink1URL: http://www.kemet.com/docfinder?Partnumber=C0603C104J4RACTU; ComponentLink1Description: http://www.kemet.com/docfinder?Partnumber=C0603C104J4RACTU; Supplier Part Number 1: 399-1097-1-ND
IC1 = 24AA512-I/SN: IC EEPROM 512KBIT 400KHZ 8SOIC; Format - Memory: EEPROMs - Serial; Memory Size: 512K (64K x 8); Speed: 100kHz, 400kHz; Interface: I²C, 2-Wire Serial; Voltage - Supply: 1.7 V ~ 5.5 V; Supplier 1: Digi-Key; Manufacturer Part Number: 24AA512-I/SN; RoHS: RoHS Compliant; Category: Integrated Circuits (ICs); Stock 1: 7846; Pricing 1: 1=1.37, 10=1.142, 25=1.0972, 100=1.0816 (EUR); Packaging: Tube; Memory Type: EEPROM; Operating Temperature: -40°C ~ 85°C; Package / Case: 8-SOIC (0.154", 3.90mm Width); Supplier Device Package: 8-SOIC N; ComponentLink1URL: http://www.microchip.com/mymicrochip/filehandler.aspx?ddocname=en546203; ComponentLink1Description: http://www.microchip.com/mymicrochip/filehandler.aspx?ddocname=en546203; Supplier Part Number 1: 24AA512-I/SN-ND
IC2 = DS3231MZ/V+: IC RTC CLK/CALENDAR I2C 8-SOIC; Time Format: HH:MM:SS (12/24 hr); Date Format: YY-MM-DD-dd; Interface: I²C, 2-Wire Serial; Voltage - Supply: 2.3 V ~ 5.5 V; Current - Timekeeping (Max): 130µA ~ 200µA @ 3.63V ~ 5.5V; Supplier 1: Digi-Key; Manufacturer Part Number: DS3231MZ/V+; RoHS: RoHS Compliant; Category: Integrated Circuits (ICs); Stock 1: 568; Pricing 1: 1=5.88, 10=5.584, 25=4.6036, 50=4.3736, 250=4.23532, 1000=3.61934 (EUR); Packaging: Tube; Type: Clock/Calendar; Features: Alarm, Leap Year, Square Wave Output; Memory Size: -; Voltage - Supply, Battery: 2.3 V ~ 5.5 V; Operating Temperature: -40°C ~ 85°C; Mounting Type: Surface Mount; Package / Case: 8-SOIC (0.154", 3.90mm Width); Supplier Device Package: 8-SOIC N; ComponentLink1URL: http://datasheets.maximintegrated.com/en/ds/DS3231M.pdf; ComponentLink1Description: http://datasheets.maximintegrated.com/en/ds/DS3231M.pdf; Supplier Part Number 1: DS3231MZ/V+-ND